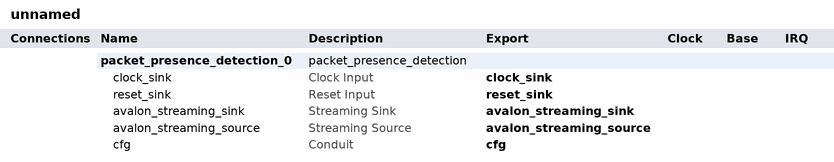
[diagram p0: system contents]
# Platform Designer (Qsys) system unnamed, MAX 10 10M16SAU169C8G
# Parameters at their usual value, and those the tool derives, are not listed.
package require qsys
create_system unnamed
set_project_property DEVICE_FAMILY {MAX 10}
set_project_property DEVICE 10M16SAU169C8G

add_instance packet_presence_detection_0 packet_presence_detection 1.0
set_instance_property packet_presence_detection_0 AUTO_EXPORT true
set_instance_parameter_value packet_presence_detection_0 DATA_WIDTH 12
set_instance_parameter_value packet_presence_detection_0 PASSTHROUGH_LEN_WIDTH 16

# exported interfaces
add_interface avalon_streaming_sink avalon_streaming sink
set_interface_property avalon_streaming_sink EXPORT_OF packet_presence_detection_0.avalon_streaming_sink
add_interface avalon_streaming_source avalon_streaming source
set_interface_property avalon_streaming_source EXPORT_OF packet_presence_detection_0.avalon_streaming_source
add_interface cfg conduit end
set_interface_property cfg EXPORT_OF packet_presence_detection_0.cfg
add_interface clock_sink clock sink
set_interface_property clock_sink EXPORT_OF packet_presence_detection_0.clock_sink
add_interface reset_sink reset sink
set_interface_property reset_sink EXPORT_OF packet_presence_detection_0.reset_sink

set_interconnect_requirement {$system} qsys_mm.clockCrossingAdapter HANDSHAKE
set_interconnect_requirement {$system} qsys_mm.enableEccProtection FALSE
set_interconnect_requirement {$system} qsys_mm.insertDefaultSlave FALSE
set_interconnect_requirement {$system} qsys_mm.maxAdditionalLatency 1

save_system unnamed.qsys
